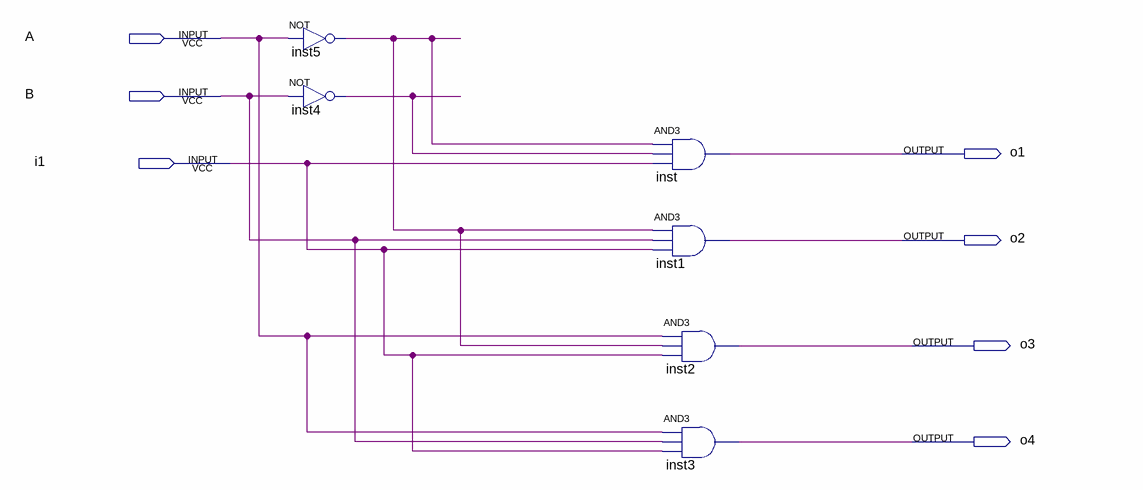
[diagram p0: schematic sheet]
// Quartus schematic demux.bdf as structural Verilog: 6 symbols, 7 pins
module demux (
  input  A,
  input  B,
  input  i1,
  output o1,
  output o2,
  output o3,
  output o4
);

  wire inst4_out, inst5_out;

  not inst5 (inst5_out, A);
  not inst4 (inst4_out, B);
  and inst (o1, inst5_out, inst4_out, i1);
  and inst1 (o2, inst5_out, B, i1);
  and inst2 (o3, A, inst5_out, i1);
  and inst3 (o4, A, B, i1);
endmodule
